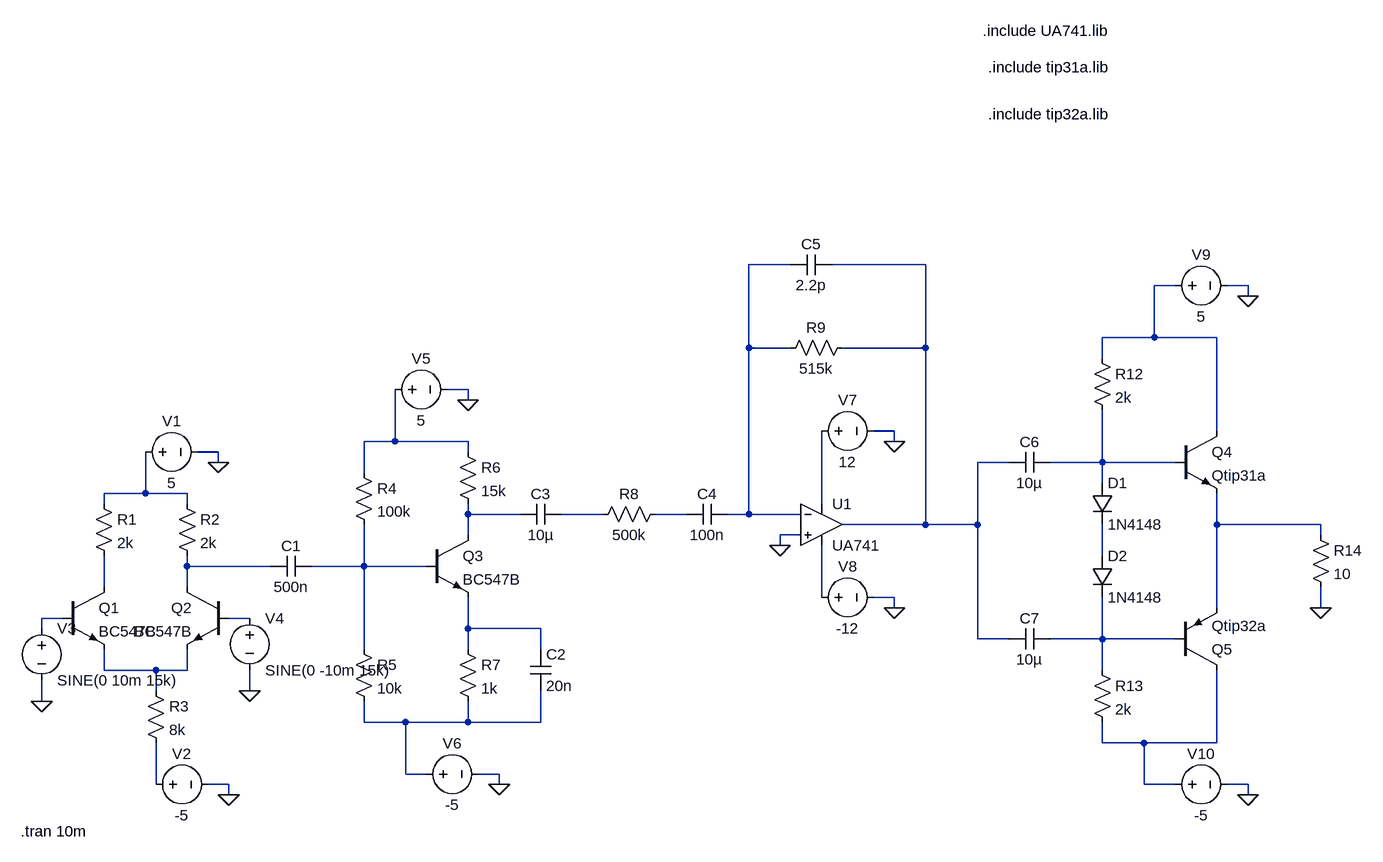
[diagram p0: schematic FINAL.asc]
FINAL.asc, the LTspice schematic file:
Version 4.1
SHEET 1 2068 680
WIRE 1184 -368 1120 -368
WIRE 1392 -368 1248 -368
WIRE 1776 -336 1744 -336
WIRE 1888 -336 1856 -336
WIRE 1888 -320 1888 -336
WIRE 1744 -256 1744 -336
WIRE 1744 -256 1664 -256
WIRE 1840 -256 1744 -256
WIRE 1120 -240 1120 -368
WIRE 1184 -240 1120 -240
WIRE 1392 -240 1392 -368
WIRE 1392 -240 1264 -240
WIRE 1664 -224 1664 -256
WIRE 688 -176 656 -176
WIRE 688 -160 688 -176
WIRE 1344 -112 1312 -112
WIRE 1840 -112 1840 -256
WIRE 576 -96 576 -176
WIRE 576 -96 528 -96
WIRE 688 -96 576 -96
WIRE 1344 -96 1344 -112
WIRE 304 -80 272 -80
WIRE 688 -80 688 -96
WIRE 304 -64 304 -80
WIRE 1520 -64 1472 -64
WIRE 1664 -64 1664 -144
WIRE 1664 -64 1584 -64
WIRE 1776 -64 1664 -64
WIRE 528 -48 528 -96
WIRE 1664 -32 1664 -64
WIRE 192 -16 192 -80
WIRE 192 -16 128 -16
WIRE 256 -16 192 -16
WIRE 128 0 128 -16
WIRE 256 0 256 -16
WIRE 1232 0 1232 -112
WIRE 688 16 688 0
WIRE 768 16 688 16
WIRE 896 16 832 16
WIRE 1024 16 976 16
WIRE 1120 16 1120 -240
WIRE 1120 16 1088 16
WIRE 1200 16 1120 16
WIRE 1392 32 1392 -240
WIRE 1392 32 1264 32
WIRE 1472 32 1472 -64
WIRE 1472 32 1392 32
WIRE 1840 32 1840 -16
WIRE 2000 32 1840 32
WIRE 688 48 688 16
WIRE 1200 48 1168 48
WIRE 2000 48 2000 32
WIRE 1168 64 1168 48
WIRE 1664 80 1664 32
WIRE 256 96 256 80
WIRE 384 96 256 96
WIRE 528 96 528 32
WIRE 528 96 448 96
WIRE 624 96 528 96
WIRE 128 128 128 80
WIRE 256 128 256 96
WIRE 1232 144 1232 64
WIRE 1344 144 1312 144
WIRE 1344 160 1344 144
WIRE 1840 160 1840 32
WIRE 2000 160 2000 128
WIRE 64 176 32 176
WIRE 352 176 320 176
WIRE 32 192 32 176
WIRE 688 192 688 144
WIRE 800 192 688 192
WIRE 1472 208 1472 32
WIRE 1520 208 1472 208
WIRE 1664 208 1664 144
WIRE 1664 208 1584 208
WIRE 1776 208 1664 208
WIRE 528 224 528 96
WIRE 688 224 688 192
WIRE 800 224 800 192
WIRE 128 256 128 224
WIRE 208 256 128 256
WIRE 256 256 256 224
WIRE 256 256 208 256
WIRE 1664 256 1664 208
WIRE 208 288 208 256
WIRE 352 288 352 256
WIRE 32 304 32 272
WIRE 528 336 528 304
WIRE 592 336 528 336
WIRE 688 336 688 304
WIRE 688 336 592 336
WIRE 800 336 800 288
WIRE 800 336 688 336
WIRE 1664 368 1664 336
WIRE 1728 368 1664 368
WIRE 1840 368 1840 256
WIRE 1840 368 1728 368
WIRE 592 416 592 336
WIRE 624 416 592 416
WIRE 736 416 704 416
WIRE 208 432 208 368
WIRE 320 432 288 432
WIRE 736 432 736 416
WIRE 1728 432 1728 368
WIRE 1776 432 1728 432
WIRE 1888 432 1856 432
WIRE 320 448 320 432
WIRE 1888 448 1888 432
FLAG 32 304 0
FLAG 352 288 0
FLAG 304 -64 0
FLAG 320 448 0
FLAG 688 -160 0
FLAG 736 432 0
FLAG 1168 64 0
FLAG 1344 -96 0
FLAG 1344 160 0
FLAG 2000 160 0
FLAG 1888 448 0
FLAG 1888 -320 0
SYMBOL npn 64 128 R0
SYMATTR InstName Q1
SYMATTR Value BC547B
SYMBOL npn 320 128 M0
SYMATTR InstName Q2
SYMATTR Value BC547B
SYMBOL res 112 -16 R0
SYMATTR InstName R1
SYMATTR Value 2k
SYMBOL res 240 -16 R0
SYMATTR InstName R2
SYMATTR Value 2k
SYMBOL res 192 272 R0
SYMATTR InstName R3
SYMATTR Value 8k
SYMBOL voltage 176 -80 R270
WINDOW 0 32 56 VTop 2
WINDOW 3 -32 56 VBottom 2
WINDOW 123 0 0 Left 0
WINDOW 39 0 0 Left 0
SYMATTR InstName V1
SYMATTR Value 5
SYMBOL voltage 192 432 R270
WINDOW 0 32 56 VTop 2
WINDOW 3 -32 56 VBottom 2
WINDOW 123 0 0 Left 0
WINDOW 39 0 0 Left 0
SYMATTR InstName V2
SYMATTR Value -5
SYMBOL voltage 32 176 R0
WINDOW 123 0 0 Left 0
WINDOW 39 0 0 Left 0
SYMATTR InstName V3
SYMATTR Value SINE(0 10m 15k)
SYMBOL voltage 352 160 R0
WINDOW 123 0 0 Left 0
WINDOW 39 0 0 Left 0
SYMATTR InstName V4
SYMATTR Value SINE(0 -10m 15k)
SYMBOL cap 448 80 R90
WINDOW 0 0 32 VBottom 2
WINDOW 3 32 32 VTop 2
SYMATTR InstName C1
SYMATTR Value 500n
SYMBOL npn 624 48 R0
SYMATTR InstName Q3
SYMATTR Value BC547B
SYMBOL res 512 -64 R0
SYMATTR InstName R4
SYMATTR Value 100k
SYMBOL res 512 208 R0
SYMATTR InstName R5
SYMATTR Value 10k
SYMBOL res 672 -96 R0
SYMATTR InstName R6
SYMATTR Value 15k
SYMBOL res 672 208 R0
SYMATTR InstName R7
SYMATTR Value 1k
SYMBOL cap 784 224 R0
SYMATTR InstName C2
SYMATTR Value 20n
SYMBOL voltage 560 -176 R270
WINDOW 0 32 56 VTop 2
WINDOW 3 -32 56 VBottom 2
SYMATTR InstName V5
SYMATTR Value 5
SYMBOL voltage 608 416 R270
WINDOW 0 32 56 VTop 2
WINDOW 3 -32 56 VBottom 2
SYMATTR InstName V6
SYMATTR Value -5
SYMBOL cap 832 0 R90
WINDOW 0 0 32 VBottom 2
WINDOW 3 32 32 VTop 2
SYMATTR InstName C3
SYMATTR Value 10µ
SYMBOL res 992 0 R90
WINDOW 0 0 56 VBottom 2
WINDOW 3 32 56 VTop 2
SYMATTR InstName R8
SYMATTR Value 500k
SYMBOL cap 1088 0 R90
WINDOW 0 0 32 VBottom 2
WINDOW 3 32 32 VTop 2
SYMATTR InstName C4
SYMATTR Value 100n
SYMBOL OpAmps\\opamp2 1232 -32 R0
SYMATTR InstName U1
SYMATTR Value UA741
SYMBOL voltage 1216 -112 R270
WINDOW 0 32 56 VTop 2
WINDOW 3 -32 56 VBottom 2
SYMATTR InstName V7
SYMATTR Value 12
SYMBOL voltage 1216 144 R270
WINDOW 0 32 56 VTop 2
WINDOW 3 -32 56 VBottom 2
SYMATTR InstName V8
SYMATTR Value -12
SYMBOL res 1280 -256 R90
WINDOW 0 0 56 VBottom 2
WINDOW 3 32 56 VTop 2
SYMATTR InstName R9
SYMATTR Value 515k
SYMBOL cap 1248 -384 R90
WINDOW 0 0 32 VBottom 2
WINDOW 3 32 32 VTop 2
SYMATTR InstName C5
SYMATTR Value 2.2p
SYMBOL cap 1584 -80 R90
WINDOW 0 0 32 VBottom 2
WINDOW 3 32 32 VTop 2
SYMATTR InstName C6
SYMATTR Value 10µ
SYMBOL cap 1584 192 R90
WINDOW 0 0 32 VBottom 2
WINDOW 3 32 32 VTop 2
SYMATTR InstName C7
SYMATTR Value 10µ
SYMBOL res 1648 -240 R0
SYMATTR InstName R12
SYMATTR Value 2k
SYMBOL res 1648 240 R0
SYMATTR InstName R13
SYMATTR Value 2k
SYMBOL npn 1776 -112 R0
SYMATTR InstName Q4
SYMATTR Value Qtip31a
SYMBOL pnp 1776 256 M180
SYMATTR InstName Q5
SYMATTR Value Qtip32a
SYMBOL res 1984 32 R0
SYMATTR InstName R14
SYMATTR Value 10
SYMBOL voltage 1760 -336 R270
WINDOW 0 32 56 VTop 2
WINDOW 3 -32 56 VBottom 2
SYMATTR InstName V9
SYMATTR Value 5
SYMBOL voltage 1760 432 R270
WINDOW 0 32 56 VTop 2
WINDOW 3 -32 56 VBottom 2
SYMATTR InstName V10
SYMATTR Value -5
SYMBOL diode 1648 -32 R0
SYMATTR InstName D1
SYMATTR Value 1N4148
SYMBOL diode 1648 80 R0
SYMATTR InstName D2
SYMATTR Value 1N4148
TEXT 1480 -728 Left 2 !.include UA741.lib
TEXT 1488 -672 Left 2 !.include tip31a.lib
TEXT 1488 -600 Left 2 !.include tip32a.lib
TEXT 0 504 Left 2 !.tran 10m

The netlist it stands for:
* FINAL.asc
Q1 N015 N017 N021 0 BC547B
Q2 N013 N018 N021 0 BC547B
R1 N006 N015 2k
R2 N006 N013 2k
R3 N021 N024 8k
V1 N006 0 5
V2 N024 0 -5
V3 N017 0 SINE(0 10m 15k)
V4 N018 0 SINE(0 -10m 15k)
C1 N014 N013 500n
Q3 N008 N014 N019 0 BC547B
R4 N004 N014 100k
R5 N014 N022 10k
R6 N004 N008 15k
R7 N019 N022 1k
C2 N019 N022 20n
V5 N004 0 5
V6 N022 0 -5
C3 N009 N008 10µ
R8 N010 N009 500k
C4 N001 N010 100n
X§U1 0 N001 N007 N016 N002 UA741  ; pins In+ In- V+ V- OUT
V7 N007 0 12
V8 N016 0 -12
R9 N002 N001 515k
C5 N002 N001 2.2p
C6 N005 N002 10µ
C7 N020 N002 10µ
R12 N003 N005 2k
R13 N020 N023 2k
Q4 N003 N005 N011 0 Qtip31a
Q5 N023 N020 N011 0 Qtip32a
R14 N011 0 10
V9 N003 0 5
V10 N023 0 -5
D1 N005 N012 1N4148
D2 N012 N020 1N4148
.model D D
.lib standard.dio
.model NPN NPN
.model PNP PNP
.lib standard.bjt
.include UA741.lib
.include tip31a.lib
.include tip32a.lib
.tran 10m
.backanno
.end